# Altium schematic sheet VRB.SchDoc
size A; SheetNumber: 4; SheetTotal: 14
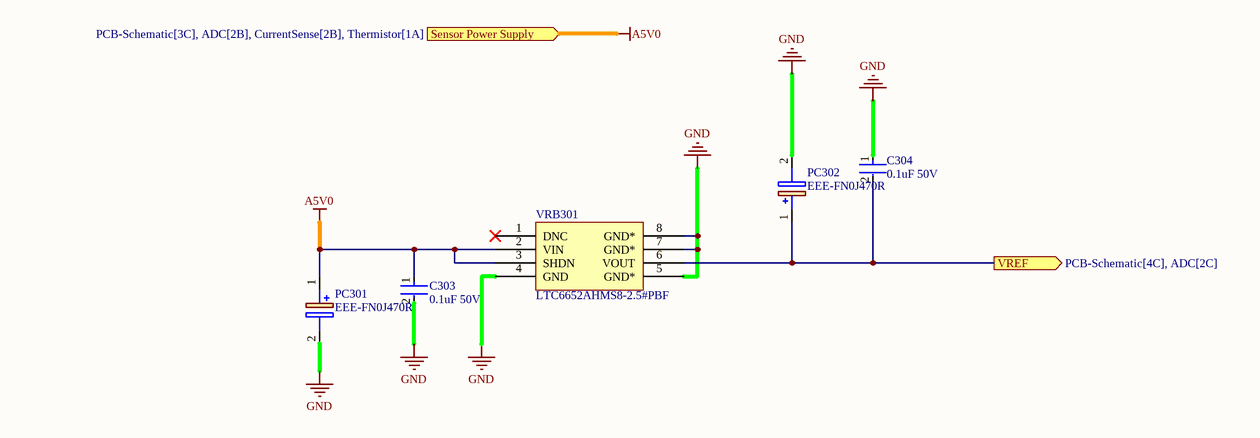
[diagram p0: VRB.SchDoc]

## Parts
C303  0.1uF 50V  [FP-CC0603-DA-MFG]
C304  0.1uF 50V  [FP-CC0603-DA-MFG]
PC301  EEE-FN0J470R  [EEE1AA220WR]
PC302  EEE-FN0J470R  [EEE1AA220WR]
VRB301  LTC6652AHMS8-2.5#PBF  [LTC6652AHMS8-2.5#PBF]

## Ports
Sensor Power Supply (in, see PCB-Schematic[3C], ADC[2B], CurrentSense[2B], Thermistor[1A]), VREF (out, see PCB-Schematic[4C], ADC[2C])

## Nets
A5V0: C303.1 PC301.1(+) VRB301.2(VIN) VRB301.3(SHDN) ; port Sensor Power Supply
GND: C303.2 C304.1 PC301.2(-) PC302.2(-) VRB301.4(GND) VRB301.5(GND*) VRB301.7(GND*) VRB301.8(GND*)
VREF: C304.2 PC302.1(+) VRB301.6(VOUT) ; port VREF

Not connected (* = marked no-connect by the designer): VRB301 1(DNC)*

## Library data of the parts
C303 C304 = CMP-03422-000468-1: CAP CER 0.1UF 50V X7R 0603; Manufacturer: YAGEO; Manufacturer Part Number: CC0603KPX7R9BB104; Temperature Coefficient: 15%; Capacitance: 100 nF; Material: Ceramic; Value: 100 nF; Tolerance: 0.1; Device Class L1: Passive Components; Temperature Range High: +125°C; ComponentLink2Description: Datasheet; Temperature Characteristic: X7R; Octopart: https://octopart.com/cc0603kpx7r9bb104-yageo-12885113; Height: 0.9mm; Mouser Description: Multilayer Ceramic Capacitors MLCC - SMD/SMT 100nF 50V X7R 10%; Device Class L3: Ceramic Capacitors; Voltage Rating: 50 V; Device Class L2: Capacitors; ComponentLink2URL: http://www.yageo.com/documents/recent/UPY-GPHC_X7R_6.3V-to-50V_18.pdf; Package: CC0603-DA; Automotive: No; Voltage: 50 V; RoHS: TRUE; Lead Free: Yes; Digikey Description: CAP CER 0.1UF 50V X7R 0603; Footprint Url: http://www.yageo.com/exep/pages/download/literatures/UPY-C_GEN_24.pdf; Temperature Range Low: -55°C; Temperature: -55°C to +125°C; Category: Cap
PC301 PC302 = EEE-FN0J470R: Capacitor Polarised; Manufacturer_Name: Panasonic; Datasheet Link: http://industrial.panasonic.com/cdbs/www-data/pdf/RDE0000/RDE0000C1259.pdf; Height: 5.5mm; Manufacturer_Part_Number: EEE-FN0J470R; Mouser Part Number: 667-EEE-FN0J470R; Mouser Price/Stock: https://www.mouser.co.uk/ProductDetail/Panasonic/EEE-FN0J470R?qs=OlC7AqGiEDnsjVsw6O9Inw%3D%3D; Arrow Part Number: EEE-FN0J470R; Arrow Price/Stock: https://www.arrow.com/en/products/eee-fn0j470r/panasonic